# Altium project ADAPTONE_SONDES.PrjPCB
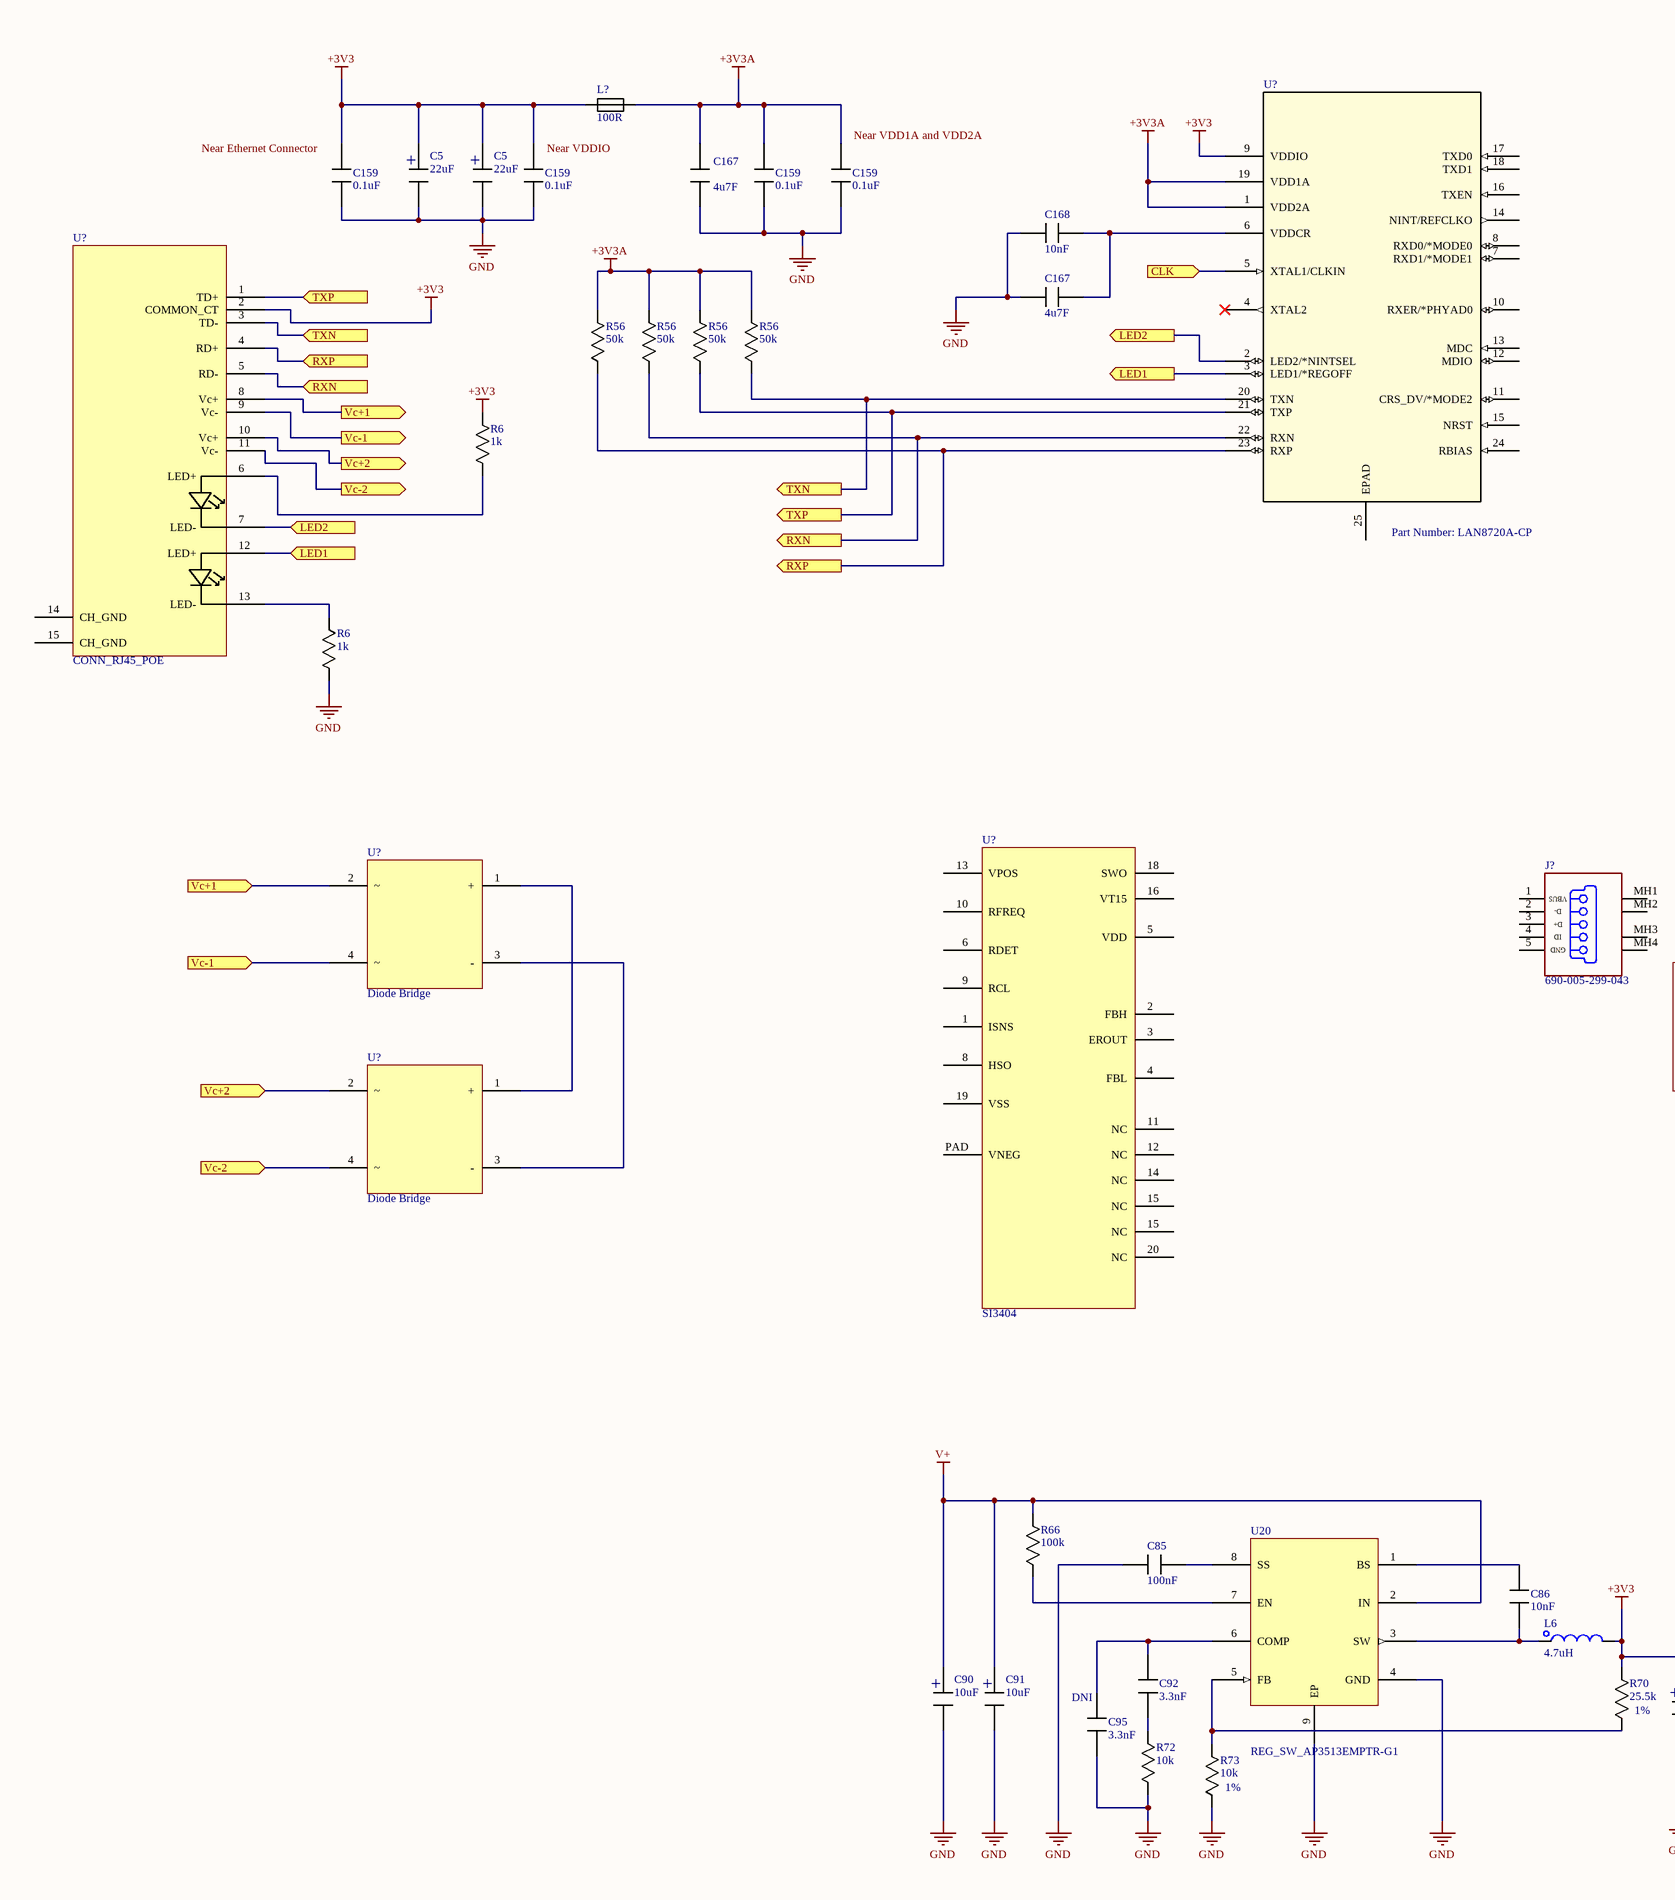
[diagram p0: sondes.SchDoc, left]
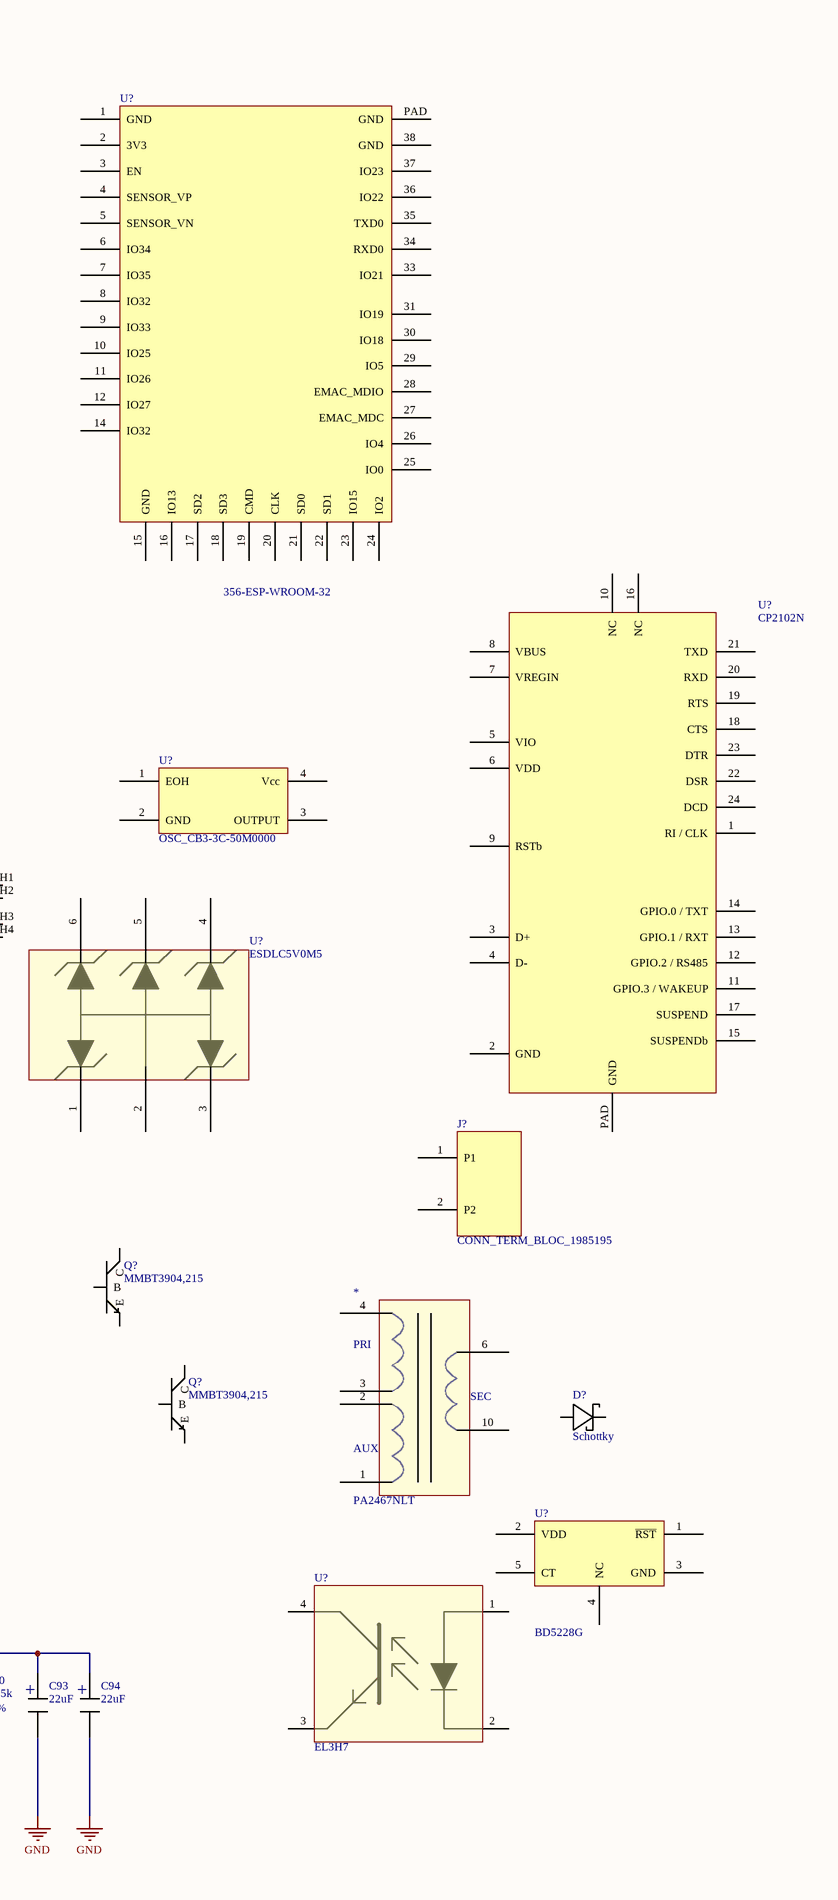
[diagram p1: sondes.SchDoc, right]
Project_Date: 2019-01-01; Project_Designer1: Pascal Lemieux; Project_Designer2: Vincent-Phillipe Réhaume; Project_Designer3: Émile Laplante; Project_Designer4: Marc-Antoine Maheux; Project_Group: Adaptone; Project_Name: Carte de son; Project_Revision: 1.00
2 sheets, 63 parts. Net scope: flat (ports and power ports of the same name join across sheets).
Sheets:
  sondes.SchDoc
  microphone.SchDoc

## Sheet sondes.SchDoc
size C

### Parts
(Parts that share a designator on the sheet are numbered #1, #2 ... from top to bottom, then left to right.)
*  PA2467NLT  [PA2467NLT]
C5#1  value 22uF  [CAP_RAD_SMD_DIA157]  (hidden comment: Capacitor_Polarized)
C5#2  value 22uF  [CAP_RAD_SMD_DIA157]  (hidden comment: Capacitor_Polarized)
C85  value 100nF  [0603]  (hidden comment: Capacitor)
C86  value 10nF  [0603]  (hidden comment: Capacitor)
C90  value 10uF  [CAP_RAD_SMD_DIA157]  (hidden comment: Capacitor_Polarized)
C91  value 10uF  [CAP_RAD_SMD_DIA157]  (hidden comment: Capacitor_Polarized)
C92  value 3.3nF  [0603]  (hidden comment: Capacitor)
C93  value 22uF  [CAP_RAD_SMD_DIA157]  (hidden comment: Capacitor_Polarized)
C94  value 22uF  [CAP_RAD_SMD_DIA157]  (hidden comment: Capacitor_Polarized)
C95  value 3.3nF  note: DNI  [0603]  (hidden comment: Capacitor)
C159#1  value 0.1uF  [0603]  (hidden comment: Capacitor)
C159#2  value 0.1uF  [0603]  (hidden comment: Capacitor)
C159#3  value 0.1uF  [0603]  (hidden comment: Capacitor)
C159#4  value 0.1uF  [0603]  (hidden comment: Capacitor)
C167#1  value 4u7F  [0805]  (hidden comment: Capacitor)
C167#2  value 4u7F  [0805]  (hidden comment: Capacitor)
C168  value 10nF  [0603]  (hidden comment: Capacitor)
D?  Schottky  [SOD-323F]
J?#1  Mfg_PN: 690-005-299-043  [CONN_USB_MINIB_690-005-299-043]  (hidden comment: USB_MINIB_690-005-299-043)
J?#2  CONN_TERM_BLOC_1985195  [TERM BLOCK]
L6  value 4.7uH  [SRN5040-4R7M]  (hidden comment: Inductor)
L?  value 100R  [0805]  (hidden comment: Ferrite)
Q?#1  Mfg_PN: MMBT3904,215  [SOT23_GDS]  (hidden comment: BJT_N_GDS)
Q?#2  Mfg_PN: MMBT3904,215  [SOT23_GDS]  (hidden comment: BJT_N_GDS)
R6#1  value 1k  [0603]  (hidden comment: Resistor)
R6#2  value 1k  [0603]  (hidden comment: Resistor)
R56#1  value 50k  [0402]  (hidden comment: Resistor)
R56#2  value 50k  [0402]  (hidden comment: Resistor)
R56#3  value 50k  [0402]  (hidden comment: Resistor)
R56#4  value 50k  [0402]  (hidden comment: Resistor)
R66  value 100k  [0603]  (hidden comment: Resistor)
R70  value 25.5k  Tolerance: 1%  [0603]  (hidden comment: Resistor)
R72  value 10k  [0603]  (hidden comment: Resistor)
R73  value 10k  Tolerance: 1%  [0603]  (hidden comment: Resistor)
U20  REG_SW_AP3513EMPTR-G1  [AP3513EMPTR-G1]
U?#1  Part Number: LAN8720A-CP  [QFN24-6X6_MC]
U?#2  356-ESP-WROOM-32
U?#3  CONN_RJ45_POE
U?#4  OSC_CB3-3C-50M0000  [OSC_50MHZ]
U?#5  CP2102N  [24-QFN]
U?#6  Diode Bridge  [4-SOPA]
U?#7  ESDLC5V0M5  [SOT563]
U?#8  SI3404
U?#9  Diode Bridge  [4-SOPA]
U?#10  BD5228G
U?#11  EL3H7

### Ports
CLK (in), LED1 (in), LED1 (out), LED2 (in), LED2 (out), RXN (in), RXN (out), RXP (in), RXP (out), TXN (in), TXN (out), TXP (in), TXP (out), Vc+1 (in), Vc+1 (out), Vc+2 (in), Vc+2 (out), Vc-1 (in), Vc-1 (out), Vc-2 (in), Vc-2 (out)

### Nets
+3V3: C5#1.+ C5#2.+ C93.+ C94.+ C159#1.1 C159#2.1 L6.2 L?.1 R6#1.2 R70.1 U?#1.9(VDDIO) U?#3.2(COMMON_CT)
+3V3A: C159#3.1 C159#4.1 C167#1.1 L?.2 R56#1.1 R56#2.1 R56#3.1 R56#4.1 U?#1.1(VDD2A) U?#1.19(VDD1A)
GND: C5#1.- C5#2.- C85.1 C90.- C91.- C93.- C94.- C95.2 C159#1.2 C159#2.2 C159#3.2 C159#4.2 C167#1.2 C167#2.1 C168.1 R6#2.1 R72.2 R73.2 U20.4(GND) U20.9(EP)
V+: C90.+ C91.+ R66.2 U20.2(IN)
NetC85_2: C85.2 U20.8(SS)
NetC86_1: C86.1 U20.1(BS)
NetC86_2: C86.2 L6.1 U20.3(SW)
NetC92_1: C92.1 C95.1 U20.6(COMP)
NetC92_2: C92.2 R72.1
NetC167#2_2: C167#2.2 C168.2 U?#1.6(VDDCR)
NetR6#1_1: R6#1.1 U?#3.6(LED+)
NetR6#2_2: R6#2.2 U?#3.13(LED-)
NetR56#1_2: R56#1.2 U?#1.23(RXP) U?#3.4(RD+) ; port RXP
NetR56#2_2: R56#2.2 U?#1.22(RXN) U?#3.5(RD-) ; port RXN
NetR56#3_2: R56#3.2 U?#1.21(TXP) U?#3.1(TD+) ; port TXP
NetR56#4_2: R56#4.2 U?#1.20(TXN) U?#3.3(TD-) ; port TXN
NetR66_1: R66.1 U20.7(EN)
NetR70_2: R70.2 R73.1 U20.5(FB)
NetU?#1_2: U?#1.2(LED2/*NINTSEL) U?#3.7(LED-) ; port LED2
NetU?#1_3: U?#1.3(LED1/*REGOFF) U?#3.12(LED+) ; port LED1
NetU?#1_5: U?#1.5(XTAL1/CLKIN) ; port CLK
NetU?#3_8: U?#3.8(Vc+) U?#6.2 ; port Vc+1
NetU?#3_9: U?#3.9(Vc-) U?#6.4 ; port Vc-1
NetU?#3_10: U?#3.10(Vc+) U?#9.2 ; port Vc+2
NetU?#3_11: U?#3.11(Vc-) U?#9.4 ; port Vc-2
NetU?#6_1: U?#6.1(+) U?#9.1(+)
NetU?#6_3: U?#6.3(-) U?#9.3(-)

Not connected (* = marked no-connect by the designer): * 1 2 3 4 6 10; D? 1(anode) 2(cathode); J?#1 1(V_BUS_(5V)) 2(D-) 3(D+) 4(NC) 5(GND) MH1(Tab) MH2(Tab) MH3(Tab) MH4(Tab); J?#2 1(P1) 2(P2); Q?#1 D(C) G(B) S(E); Q?#2 D(C) G(B) S(E); U?#1 4(XTAL2)* 7(RXD1/*MODE1) 8(RXD0/*MODE0) 10(RXER/*PHYAD0) 11(CRS_DV/*MODE2) 12(MDIO) 13(MDC) 14(NINT/REFCLKO) 15(NRST) 16(TXEN) 17(TXD0) 18(TXD1) 24(RBIAS) 25(EPAD); U?#2 1(GND) 2(3V3) 3(EN) 4(SENSOR_VP) 5(SENSOR_VN) 6(IO34) 7(IO35) 8(IO32) 9(IO33) 10(IO25) 11(IO26) 12(IO27) 14(IO32) 15(GND) 16(IO13) 17(SD2) 18(SD3) 19(CMD) 20(CLK) 21(SD0) 22(SD1) 23(IO15) 24(IO2) 25(IO0) 26(IO4) 27(EMAC_MDC) 28(EMAC_MDIO) 29(IO5) 30(IO18) 31(IO19) 33(IO21) 34(RXD0) 35(TXD0) 36(IO22) 37(IO23) 38(GND) PAD(GND); U?#3 14(CH_GND) 15(CH_GND); U?#4 1(EOH) 2(GND) 3(OUTPUT) 4(Vcc); U?#5 1(RI_/_CLK) 2(GND) 3(D+) 4(D-) 5(VIO) 6(VDD) 7(VREGIN) 8(VBUS) 9(RSTb) 10(NC) 11(GPIO.3_/_WAKEUP) 12(GPIO.2_/_RS485) 13(GPIO.1_/_RXT) 14(GPIO.0_/_TXT) 15(SUSPENDb) 16(NC) 17(SUSPEND) 18(CTS) 19(RTS) 20(RXD) 21(TXD) 22(DSR) 23(DTR) 24(DCD) PAD(GND); U?#7 1 2 3 4 5 6; U?#8 1(ISNS) 2(FBH) 3(EROUT) 4(FBL) 5(VDD) 6(RDET) 8(HSO) 9(RCL) 10(RFREQ) 11(NC) 12(NC) 13(VPOS) 14(NC) 15(NC) 16(VT15) 18(SWO) 19(VSS) 20(NC) PAD(VNEG); U?#10 1(~{RST}) 2(VDD) 3(GND) 4(NC) 5(CT); U?#11 1 2 3 4

### Notes on the sheet
- Labels drawn without touching a wire or pin: Near Ethernet Connector, Near VDD1A and VDD2A, Near VDDIO
- Title
- Size:
- Date:
- File:
- C
- Number:
- Time:
- Revision:
- Sheet
- of
- (in symbol PA2467NLT) PRI; SEC; AUX
- (in symbol USB_MINIB_690-005-299-043) VBUS; ID

### Library data of the parts
C5#1 C5#2 = Capacitor_Polarized: Capacitor; Mfg: Panasonic; Mfg_PN: Part Number EEE-FT1V220AR; HelpURL: *; NI: *; Supplier1: Digikey; Supplier1_PN: PCE5012CT-ND; Tolerance: *; Type: *; Rating: *
C85 C159#1-C159#4 = Capacitor: Mfg: Samsung; Mfg_PN: CL10F104ZO8NNNC; HelpURL: *; Supplier1: Digikey; Supplier1_PN: 1276-1258-1-ND; Tolerance: *; Type: *; Rating: *
  C85: NI: NI
  C159#1-C159#4: NI: *
C86 = Capacitor: Mfg: Samsung; Mfg_PN: CL10B102KB8NNNC; HelpURL: https://www.digikey.ca/product-detail/en/samsung-electro-mechanics/CL10B102KB8NNNC/1276-1018-1-ND/3889104; NI: NI; Supplier1: Digikey; Supplier1_PN: 1276-1018-1-ND; Tolerance: *; Type: *; Rating: *
C90 C91 C93 C94 = Capacitor_Polarized: Capacitor; Mfg: Nichicon; Mfg_PN: UWX1C100MCL1GB; HelpURL: *; NI: *; Supplier1: Digikey; Supplier1_PN: 493-2100-1-ND; Tolerance: *; Type: *; Rating: *
C92 C95 = Capacitor: Mfg: Samsung; Mfg_PN: CL10B332JB8NNNC; HelpURL: *; NI: NI; Supplier1: Digikey; Supplier1_PN: 1276-2030-1-ND; Tolerance: *; Type: *; Rating: *
C167#1 C167#2 = Capacitor: Mfg: Samsung; Mfg_PN: CL21A475KAQNNNG; HelpURL: *; NI: *; Supplier1: Digikey; Supplier1_PN: 1276-6462-1-ND; Tolerance: *; Type: *; Rating: *
C168 = Capacitor: Mfg: Murata; Mfg_PN: CL05B103KO5NNNC; HelpURL: *; NI: *; Supplier1: Digikey; Supplier1_PN: 1276-1051-1-ND; Tolerance: *; Type: *; Rating: *
D? = Schottky: Mfg Part Number: PMEG3020EJ,115; Mfg: Nexperia USA Inc.; CreatedBy: Emile Laplante; HelpURL: *; NI: *; Package: *; Power: *; Supplier: Digi-Key; Supplier Part Numer: 1727-3874-1-ND; Temperature: *; Value: *; VerifiedBy: *; Voltage: *
J?#1 = USB_MINIB_690-005-299-043: USB On-The-Go (OTG) Mini-B Receptacle, Right Angle, SMT, 0.80mm (.031") Pitch, Solder Tabs with Back Cover, Recessed Type; Mfg: EDAC; Supplier1: Digikey; Supplier1_PN: 151-1206-1-ND
J?#2 = CONN_TERM_BLOC_1985195: Mfg: Phoenix Contact; CreatedBy: Emile Laplante; HelpURL: https://www.digikey.ca/product-detail/en/phoenix-contact/1985195/277-1622-ND/568659; Mfg Part Number: 1985195; NI: *; Package: RJ45; Power: *; Supplier: Digikey; Supplier Part Numer: 277-1622-ND; Temperature: *; Value: *; VerifiedBy: *; Voltage: *
L6 = Inductor: Mfg: Bourns Inc.; HelpURL: *; Mfg_PN: SRN5040-4R7M; NI: *; Rating: *; Tolerance: *; Supplier1: Digikey; Supplier1_PN: SRN5040-4R7MCT-ND
L? = Ferrite: Mfg: Bourns; Mfg_PN: MH2029-101Y; Rating: 1A; HelpURL: *; NI: *; Supplier1: Digikey; Supplier1_PN: MH2029-101YCT-ND; Tolerance: *; Type: *
Q?#1 Q?#2 = BJT_N_GDS: BJT NPN; Mfg: NXP; HelpURL: *; NI: *; Rating: *; Supplier1: Digikey; Supplier1_PN: 568-4510-1-ND; Tolerance: *; Type: *; Value: *
R6#1 R6#2 = Resistor: Mfg: Yageo; Mfg_PN: RC0603JR-071KL; HelpURL: *; NI: *; Supplier1: Digikey; Supplier1_PN: 311-1.0KGRCT-ND; Type: *; Rating: *; Tolerance: *
R56#1-R56#4 = Resistor: Mfg: Yageo; Mfg_PN: 311-10GRCT-ND; HelpURL: *; NI: *; Supplier1: Digikey; Supplier1_PN: 311-100KGRCT-ND; Type: *; Rating: *; Tolerance: *
R66 = Resistor: Mfg: Stackpole Electronics Inc; Mfg_PN: RMCF0603FT100K; HelpURL: https://www.digikey.ca/product-detail/en/stackpole-electronics-inc/RMCF0603FT100K/RMCF0603FT100KCT-ND/1943118; NI: *; Supplier1: Digikey; Supplier1_PN: RMCF0603FT100KCT-ND; Type: *; Rating: *; Tolerance: *
R70 = Resistor: Mfg: Stackpole Electronics Inc; Mfg_PN: RMCF0603FT25K5; HelpURL: *; NI: *; Supplier1: Digikey; Supplier1_PN: RMCF0603FT25K5CT-ND; Type: *; Rating: *
R72 = Resistor: Mfg: Yageo; Mfg_PN: RC0603JR-0710KL; HelpURL: *; NI: *; Supplier1: Digikey; Supplier1_PN: 311-10KGRCT-ND; Type: *; Rating: *; Tolerance: *
R73 = Resistor: Mfg: Stackpole Electronics Inc; Mfg_PN: RNCP0603FTD10K0; HelpURL: *; NI: *; Supplier1: Digikey; Supplier1_PN: RNCP0603FTD10K0CT-ND; Type: *; Rating: *
U20 = REG_SW_AP3513EMPTR-G1: Mfg: Diodes Incorporated; CreatedBy: Emile Laplante; HelpURL: https://www.digikey.ca/product-detail/en/diodes-incorporated/AP3513EMPTR-G1/AP3513EMPTR-G1DICT-ND/4505181; Mfg Part Number: AP3513EMPTR-G1; NI: *; Power: *; Supplier: Digikey; Supplier Part Numer: AP3513EMPTR-G1DICT-ND; Temperature: *; Value: *; VerifiedBy: *; Voltage: *
U?#1 = LAN8720A-CP: No Description Available; Vendor: Microchip; Built_By: EMA_UL_Team; Manufacturer_Part_Number: LAN8720A-CP; Copyright: Copyright (C) 2018 Accelerated Designs. All rights reserved; RefDes: RefDes; Type: DEV; Value: Value
U?#2 = 356-ESP-WROOM-32: Mfg Part Number: ESP32-WROOM-32; Mfg: Espressif Systems; CreatedBy: Emile Laplante; HelpURL: https://www.mouser.ca/ProductDetail/Espressif-Systems/ESP32-WROOM-32?qs=sGAEpiMZZMve4%2FbfQkoj%252BErywZNi%252BCNNpLVbrj2524g%3D; NI: *; Power: *; Supplier: Mouser; Supplier Part Numer: 356-ESP-WROOM-32; Temperature: *; Value: *; VerifiedBy: *; Voltage: *
U?#3 = CONN_RJ45_POE: Mfg Part Number: SI-52003-F; Mfg: Stewart Connector; CreatedBy: Emile Laplante; HelpURL: https://www.digikey.ca/product-detail/en/stewart-connector/SI-52003-F/380-1119-ND/1635087; NI: *; Package: RJ45; Power: *; Supplier: Digikey; Supplier Part Numer: 380-1119-ND; Temperature: *; Value: *; VerifiedBy: *; Voltage: *
U?#4 = OSC_CB3-3C-50M0000: Mfg: CTS-Frequency Controls; CreatedBy: Emile Laplante; HelpURL: https://www.digikey.ca/product-detail/en/rohm-semiconductor/BD5228G-TR/BD5228GTR-ND/722780; Mfg Part Number: CB3-3C-50M0000; NI: *; Power: *; Supplier: digikey; Supplier Part Numer: CTX283CT-ND; Temperature: *; Value: *; VerifiedBy: *; Voltage: *
U?#5 = CP2102N: Mfg Part Number: CP2102N-A01-GQFN24R; Mfg: Silicon Labs; CreatedBy: Emile Laplante; HelpURL: https://www.digikey.ca/product-detail/en/silicon-labs/CP2102N-A01-GQFN24R/336-4737-1-ND/8610993; NI: *; Power: *; Supplier: digikey; Supplier Part Numer: 336-4737-1-ND; Temperature: *; Value: *; VerifiedBy: *; Voltage: *
U?#6 U?#9 = Diode Bridge: Mfg Part Number: ABS210-13; Mfg: Diodes Incorporated; CreatedBy: Emile Laplante; HelpURL: https://www.digikey.ca/product-detail/en/on-semiconductor/MC78M05CDTRKG/MC78M05CDTRKGOSCT-ND/1139757; NI: *; Package: *; Power: *; Supplier: digikey; Supplier Part Numer: ABS210-13DICT-ND; Temperature: *; Value: *; VerifiedBy: *; Voltage: *
U?#7 = ESDLC5V0M5: TVS DIODE 5.25V 17V SOT23-6; Mfg Part Number: USBLC6-2SC6; Mfg: STMicroelectronics; CreatedBy: Emile Laplante; HelpURL: https://www.digikey.ca/product-detail/en/stmicroelectronics/USBLC6-2SC6/497-5235-1-ND/1121688?utm_adgroup=Circuit+Protection&mkwid=s0ppeewL7&pcrid=87194116385&pkw=&pmt=b&pdv=c&productid=&slid=&gclid=CjwKCAjw4NrpBRBsEiwAUcLcDNQgq04tCT7V_ltqca1_7K0mXBX7kE7yGsg9_XCY2KLJWZ-Y93zq1BoCPw0QAvD_BwE; NI: *; Package: *; Power: *; Supplier: Digi-Key; Supplier Part Numer: 497-5235-1-ND; Temperature: *; Value: *; VerifiedBy: *; Voltage: *
U?#8 = SI3404: Mfg Part Number: SI3404-A-GM; Mfg: Silicon Labs; CreatedBy: Emile Laplante; HelpURL: https://www.digikey.ca/product-detail/en/silicon-labs/SI3404-A-GM/336-4270-ND/7897442; NI: *; Package: 20-VFQFN Exposed Pad; Power: *; Supplier: Digikey; Supplier Part Numer: 336-4270-ND; Temperature: *; Value: *; VerifiedBy: *; Voltage: *
U?#10 = BD5228G: Mfg Part Number: ESP32-WROOM-32; Mfg: Rohm Semiconductor; CreatedBy: Emile Laplante; HelpURL: https://www.digikey.ca/product-detail/en/rohm-semiconductor/BD5228G-TR/BD5228GTR-ND/722780; NI: *; Power: *; Supplier: digikey; Supplier Part Numer: BD5228GTR-ND; Temperature: *; Value: *; VerifiedBy: *; Voltage: *
U?#11 = EL3H7: TVS DIODE 5.25V 17V SOT23-6; Mfg Part Number: EL3H7(B)(TA)-VG; Mfg: Everlight Electronics Co Ltd; CreatedBy: Emile Laplante; HelpURL: https://www.digikey.ca/product-detail/en/everlight-electronics-co-ltd/EL3H7-B-TA-VG/1080-1197-2-ND/2675688; NI: *; Package: *; Power: *; Supplier: Digi-Key; Supplier Part Numer: 1080-1197-2-ND; Temperature: *; Value: *; VerifiedBy: *; Voltage: *

## Sheet microphone.SchDoc
size A3
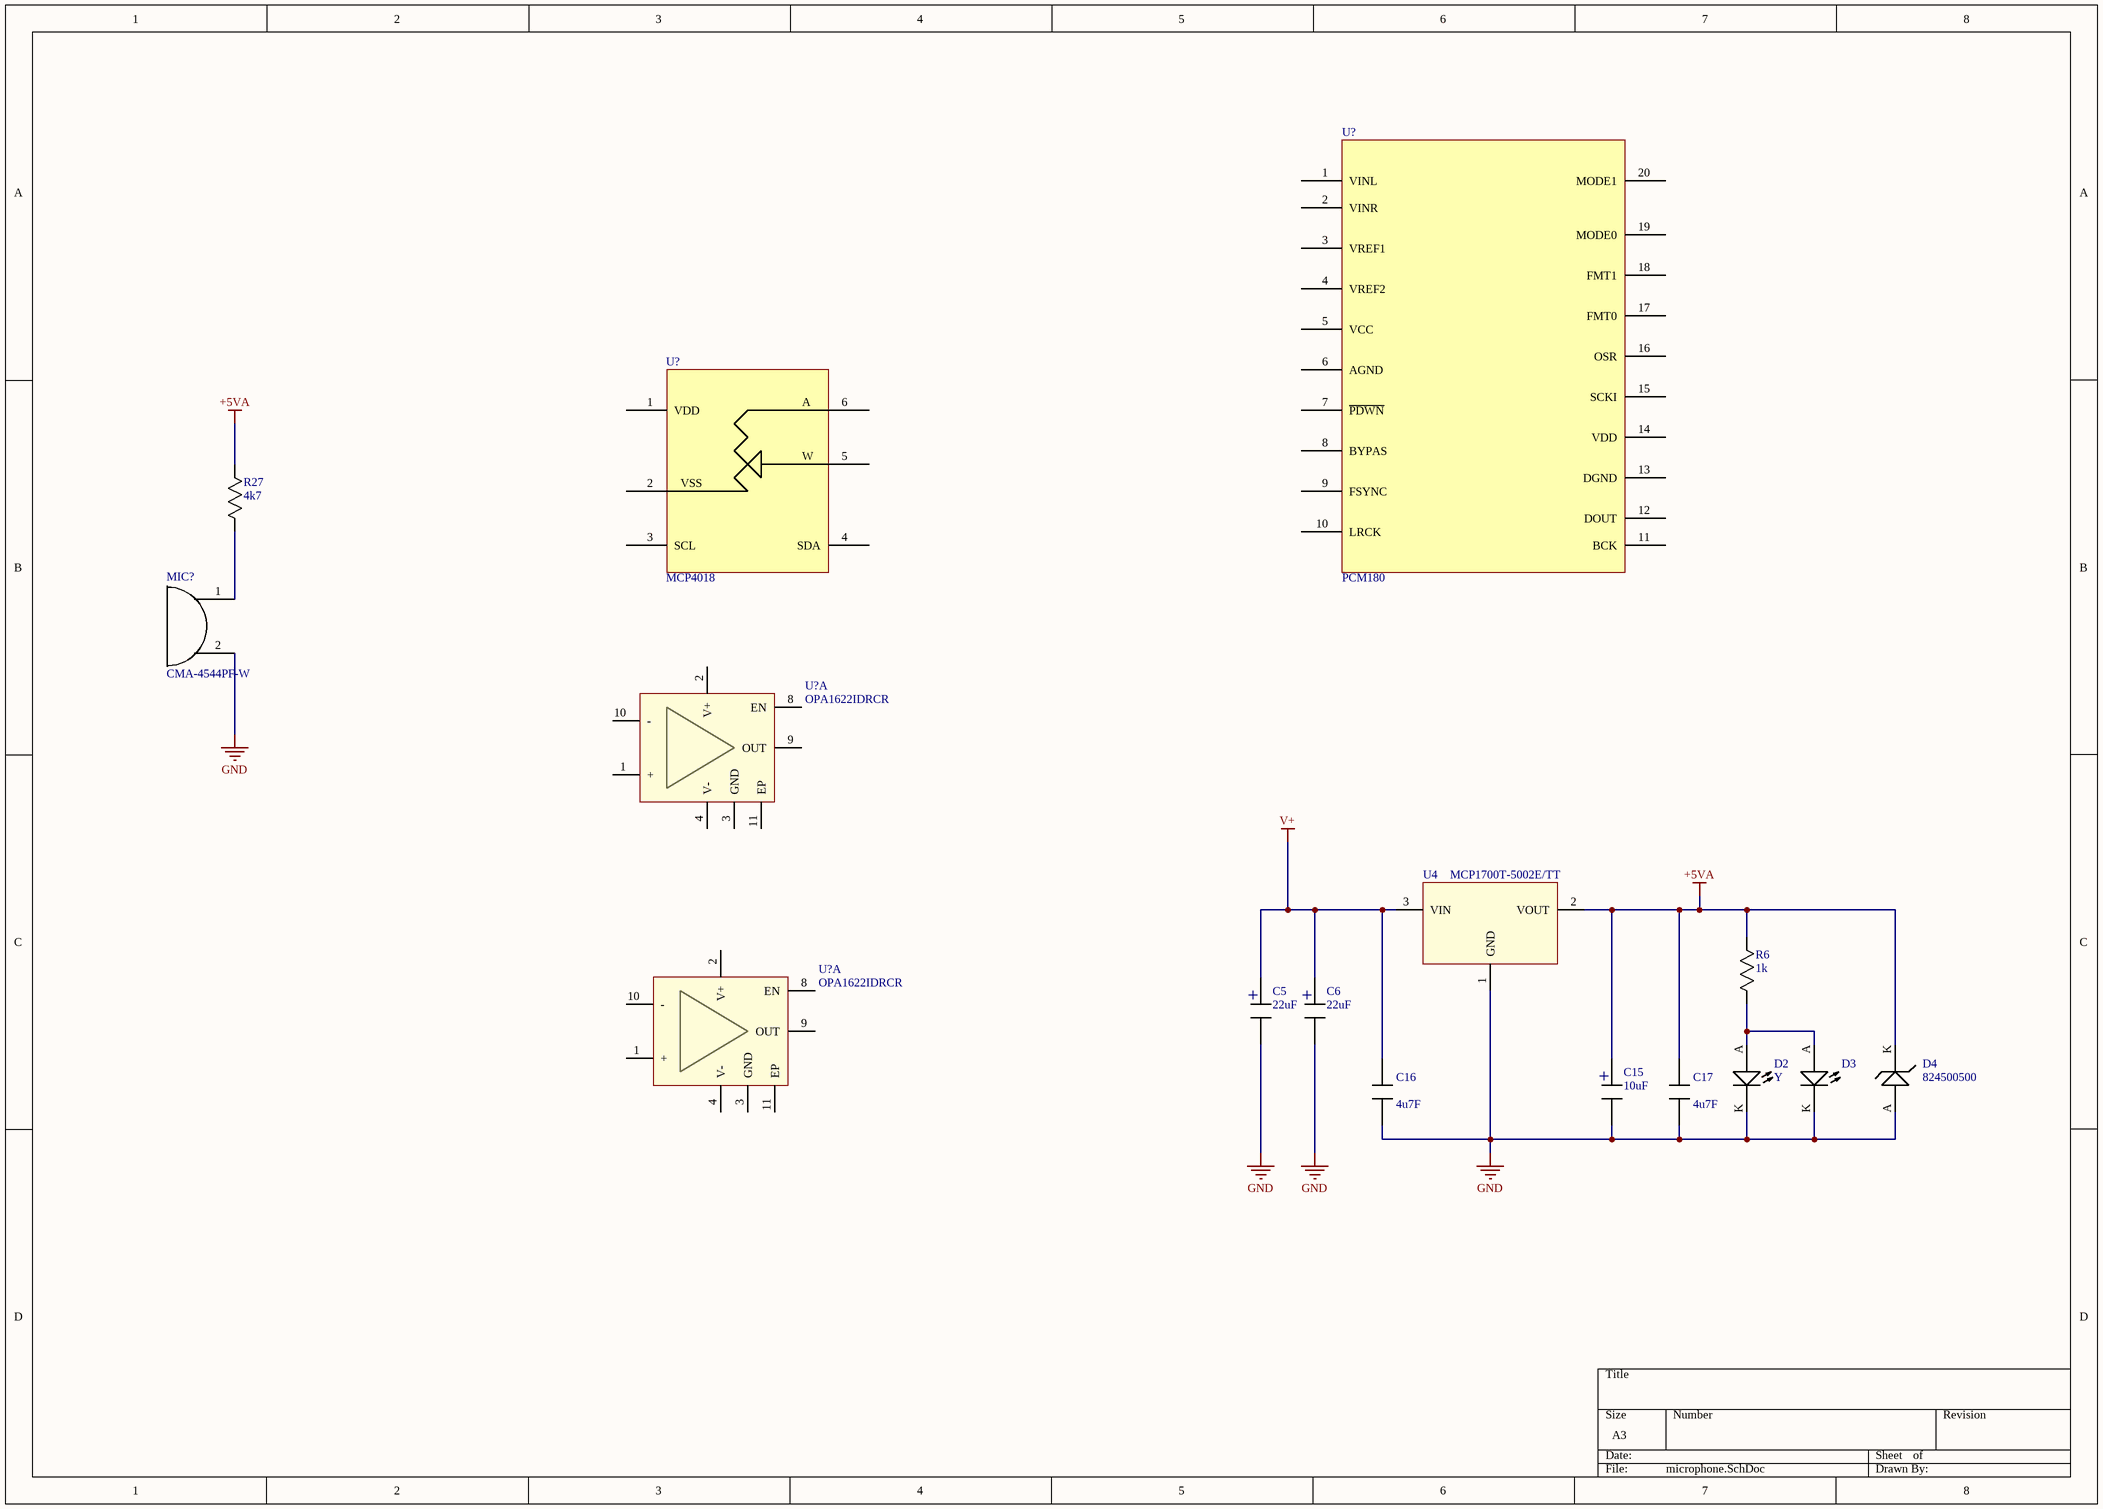
[diagram p2: microphone.SchDoc]

### Parts
(Parts that share a designator on the sheet are numbered #1, #2 ... from top to bottom, then left to right.)
C5#3  value 22uF  [CAP_RAD_SMD_DIA157]  (hidden comment: Capacitor_Polarized)
C6  value 22uF  [CAP_RAD_SMD_DIA157]  (hidden comment: Capacitor_Polarized)
C15  value 10uF  [CAP_RAD_SMD_DIA157]  (hidden comment: Capacitor_Polarized)
C16  value 4u7F  [0805]  (hidden comment: Capacitor)
C17  value 4u7F  [0603]  (hidden comment: Capacitor)
D2  Type: Y  [0805_LED]  (hidden comment: Diode_LED)
D3  Diode_LED  [0805_LED]  (value not drawn)
D4  Mfg_PN: 824500500  [DIODE_DO-214AC/SMA]  (hidden comment: Diode_zener)
MIC?  CMA-4544PF-W  [MIC]
R6#3  value 1k  [0603]  (hidden comment: Resistor)
R27  value 4k7  [0603]  (hidden comment: Resistor)
U4  Mfg_PN: MCP1700T-5002E/TT  [SOT23_132]  (hidden comment: MCP1700)
U?#12  PCM180  [20-SSOP]
U?#13  MCP4018  [6-TSSOP]
U?#14  Mfg_PN: OPA1622IDRCR  [10-VFDFN]  (hidden comment: OPA1622)  (part A of 2)
U?#15  Mfg_PN: OPA1622IDRCR  [10-VFDFN]  (hidden comment: OPA1622)  (part A of 2)

### Nets
+5VA: C15.+ C17.1 D4.K R6#3.2 R27.1 U4.2(VOUT)
GND: C5#3.- C6.- C15.- C16.2 C17.2 D2.K D3.K D4.A U4.1(GND)
V+: C5#3.+ C6.+ C16.1 U4.3(VIN)
NetD2_A: D2.A D3.A R6#3.1

Not connected (* = marked no-connect by the designer): MIC? 1 2; R27 2; U?#12 1(VINL) 2(VINR) 3(VREF1) 4(VREF2) 5(VCC) 6(AGND) 7(~{PDWN}) 8(BYPAS) 9(FSYNC) 10(LRCK) 11(BCK) 12(DOUT) 13(DGND) 14(VDD) 15(SCKI) 16(OSR) 17(FMT0) 18(FMT1) 19(MODE0) 20(MODE1); U?#13 1(VDD) 2(VSS) 3(SCL) 4(SDA) 5(W) 6(A); U?#14 1(+) 2(V+) 3(GND) 4(V-) 8(EN) 9(OUT) 10(-) 11(EP); U?#15 1(+) 2(V+) 3(GND) 4(V-) 8(EN) 9(OUT) 10(-) 11(EP)

### Library data of the parts
C5#3 = Capacitor_Polarized: as C5#1 on sheet sondes; HelpURL: *; NI: *; Supplier1: Digikey; Supplier1_PN: PCE5012CT-ND; Tolerance: *; Type: *; Rating: *
C6 = Capacitor_Polarized: Capacitor; Mfg: Panasonic; Mfg_PN: EEE-FT1V220AR; HelpURL: *; NI: *; Supplier1: Digikey; Supplier1_PN: PCE5012CT-ND; Tolerance: *; Type: *; Rating: *
C15 = Capacitor_Polarized: as C90 on sheet sondes; HelpURL: *; NI: *; Supplier1: Digikey; Supplier1_PN: 493-2100-1-ND; Tolerance: *; Type: *; Rating: *
C16 C17 = Capacitor: Mfg: Samsung; Mfg_PN: CL21A475KAQNNNG; HelpURL: *; NI: *; Supplier1: Digikey; Supplier1_PN: 1276-6462-1-ND; Tolerance: *; Type: *; Rating: *
D2 = Diode_LED: LED; Mfg: Osram; Mfg_PN: LY R976-PS-36; HelpURL: *; NI: *; Supplier1: Digikey; Supplier1_PN: 475-2560-1-ND; Tolerance: *; Rating: *; Value: *
D3 = Diode_LED: LED; Mfg: Osram; Mfg_PN: LY R976-PS-36; Type: Y; HelpURL: *; Supplier1: Digikey; Supplier1_PN: 475-2560-1-ND; Tolerance: *; Rating: *; Value: *
D4 = Diode_zener: Diode; Mfg: Wurth; HelpURL: *; NI: *; Supplier1: Digikey; Supplier1_PN: 732-9974-1-ND; Tolerance: *; Type: *; Rating: *; Value: *
MIC? = CMA-4544PF-W: Mfg: CUI Inc.; CreatedBy: Emile Laplante; HelpURL: https://www.digikey.ca/product-detail/en/cui-inc/CMA-4544PF-W/102-1721-ND/1869981; Mfg Part Number: CMA-4544PF-W; NI: *; Package: *; Power: *; Supplier: Digi-Key; Supplier Part Numer: 102-1721-ND; Temperature: *; Value: *; VerifiedBy: *; Voltage: *
R6#3 = Resistor: Mfg: Yageo; Mfg_PN: RC0603JR-071KL; HelpURL: *; NI: *; Supplier1: Digikey; Supplier1_PN: 311-1.0KGRCT-ND; Type: *; Rating: *; Tolerance: *
R27 = Resistor: Mfg: Yageo; Mfg_PN: RC0603JR-074K7L; HelpURL: *; NI: *; Supplier1: Digikey; Supplier1_PN: 311-4.7KGRCT-ND; Type: *; Rating: *; Tolerance: *
U4 = MCP1700: Linear voltage regulator; Mfg: Microchip; HelpURL: http://ww1.microchip.com/downloads/en/DeviceDoc/20001826C.pdf; NI: *; Supplier1: Digikey; Supplier1_PN: MCP1700T5002ETTCT-ND; Type: *
U?#12 = PCM180: Mfg Part Number: PCM1802DBR; Mfg: Texas Instruments; CreatedBy: Emile Laplante; HelpURL: https://www.digikey.ca/product-detail/en/texas-instruments/PCM1802DBR/296-26304-1-ND/2254955; NI: *; Power: *; Supplier: digikey; Supplier Part Numer: 296-26304-1-ND; Temperature: *; Value: *; VerifiedBy: *; Voltage: *
U?#13 = MCP4018: Mfg Part Number: MCP4018T-503E/LT; Mfg: Microchip Technology; CreatedBy: Emile Laplante; HelpURL: https://www.digikey.ca/product-detail/en/microchip-technology/MCP4018T-503E-LT/MCP4018T-503E-LTCT-ND/2060154; NI: *; Power: *; Supplier: digikey; Supplier Part Numer: MCP4018T-503E/LTCT-ND; Temperature: *; Value: *; VerifiedBy: *; Voltage: *
U?#14 U?#15 = OPA1622: Dual amplifier (headphone driver); Mfg: Texas Instruments; HelpURL: *; NI: *; Rating: *; Supplier1: Digikey; Supplier1_PN: 296-45038-1-ND; Tolerance: *; Value: *

## Nets that join several sheets
GND: sondes (20 pins), microphone (9 pins)
V+: sondes (C90.+ C91.+ R66.2 U20.2), microphone (C5#3.+ C6.+ C16.1 U4.3)